# Altium schematic sheet 2-RJ45.SchDoc
size A3
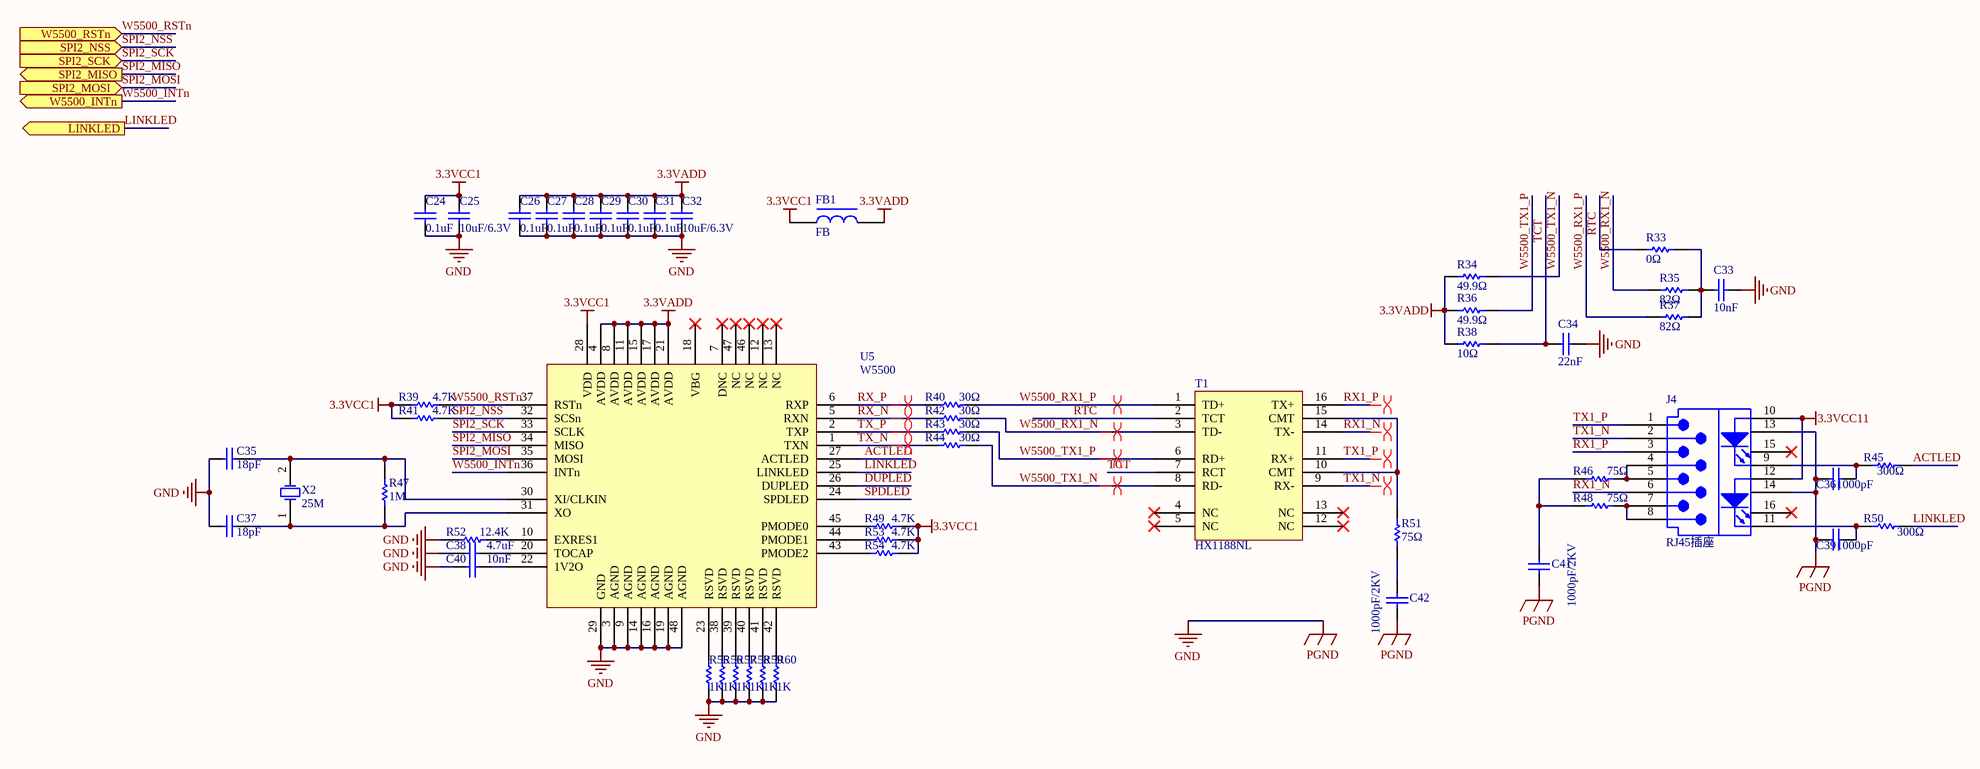
[diagram p0: 2-RJ45.SchDoc]

## Parts
C24  0.1uF  [C0603]
C25  10uF/6.3V  [C0603]
C26  0.1uF  [C0603]
C27  0.1uF  [C0603]
C28  0.1uF  [C0603]
C29  0.1uF  [C0603]
C30  0.1uF  [C0603]
C31  0.1uF  [C0603]
C32  10uF/6.3V  [C0603]
C33  10nF  [C0603]
C34  22nF  [C0603]
C35  18pF  [C0603]
C36  1000pF  [C0603]
C37  18pF  [C0603]
C38  4.7uF  [C0603]
C39  1000pF  [C0603]
C40  10nF  [C0603]
C41  1000pF/2KV  [C1206]
C42  1000pF/2KV  [C1206]
FB1  FB  [L0805]
J4  RJ45插座  [RJ45TH-1x1-2R54-LED]
R33  0Ω  [R0603]
R34  49.9Ω  [R0603]
R35  82Ω  [R0603]
R36  49.9Ω  [R0603]
R37  82Ω  [R0603]
R38  10Ω  [R0603]
R39  4.7K  [R0603]
R40  30Ω  [R0603]
R41  4.7K  [R0603]
R42  30Ω  [R0603]
R43  30Ω  [R0603]
R44  30Ω  [R0603]
R45  300Ω  [R0603]
R46  75Ω  [R0805]
R47  1M  [R0603]
R48  75Ω  [R0805]
R49  4.7K  [R0603]
R50  300Ω  [R0603]
R51  75Ω  [R1206]
R52  12.4K  [R0603]
R53  4.7K  [R0603]
R54  4.7K  [R0603]
R55  1K  [R0603]
R56  1K  [R0603]
R57  1K  [R0603]
R58  1K  [R0603]
R59  1K  [R0603]
R60  1K  [R0603]
T1  HX1188NL  [SOP16-1R27-7R11x12R7]
U5  W5500  [TQFN48-0R5-7X7]
X2  25M  [CRY2SM-6R0x3R5]

## Ports
LINKLED (out), SPI2_MISO (out), SPI2_MOSI (in), SPI2_NSS (in), SPI2_SCK (in), W5500_INTn (out), W5500_RSTn (in)

## Nets
3.3VADD: C26.2 C27.2 C28.2 C29.2 C30.2 C31.2 C32.2 FB1.2 R34.2 R36.2 R38.2 U5.4(AVDD) U5.8(AVDD) U5.11(AVDD) U5.15(AVDD) U5.17(AVDD) U5.21(AVDD)
3.3VCC1: C24.2 C25.2 FB1.1 R39.2 R41.2 R49.2 R53.2 R54.2 U5.28(VDD)
3.3VCC11: J4.10(A1) J4.12(A2)
GND: C24.1 C25.1 C26.1 C27.1 C28.1 C29.1 C30.1 C31.1 C32.1 C33.1 C34.1 C35.1 C36.1 C37.1 C38.1 C39.1 C40.1 C41.1 C42.1 J4.13 J4.14 R52.1 R55.1 R56.1 R57.1 R58.1 R59.1 R60.1 U5.3(AGND) U5.9(AGND) U5.14(AGND) U5.16(AGND) U5.19(AGND) U5.29(GND) U5.48(AGND)  [also labelled PGND]
ACTLED: R45.2 U5.27(ACTLED)
DUPLED: U5.26(DUPLED)
LINKLED: R50.2 U5.25(LINKLED) ; port LINKLED
RTC: R33.2 T1.2(TCT)
RX1_N: J4.6(RX-) T1.14(TX-)
RX1_P: J4.3(RX+) T1.16(TX+)
RX_N: R42.1 U5.5(RXN)
RX_P: R40.1 U5.6(RXP)
SPDLED: U5.24(SPDLED)
SPI2_MISO: U5.34(MISO) ; port SPI2_MISO
SPI2_MOSI: U5.35(MOSI) ; port SPI2_MOSI
SPI2_NSS: R41.1 U5.32(SCSn) ; port SPI2_NSS
SPI2_SCK: U5.33(SCLK) ; port SPI2_SCK
TCT: C34.2 R38.1 T1.7(RCT)
TX1_N: J4.2(TX-) T1.9(RX-)
TX1_P: J4.1(TX+) T1.11(RX+)
TX_N: R44.1 U5.1(TXN)
TX_P: R43.1 U5.2(TXP)
W5500_INTn: U5.36(INTn) ; port W5500_INTn
W5500_RSTn: R39.1 U5.37(RSTn) ; port W5500_RSTn
W5500_RX1_N: R35.2 R42.2 T1.3(TD-)
W5500_RX1_P: R37.2 R40.2 T1.1(TD+)
W5500_TX1_N: R34.1 R44.2 T1.8(RD-)
W5500_TX1_P: R36.1 R43.2 T1.6(RD+)
NetC33_2: C33.2 R33.1 R35.1 R37.1
NetC35_2: C35.2 R47.2 U5.30(XI/CLKIN) X2.2(OSC2)
NetC36_2: C36.2 J4.9(K1) R45.1
NetC37_2: C37.2 R47.1 U5.31(XO) X2.1(OSC1)
NetC38_2: C38.2 U5.20(TOCAP)
NetC39_2: C39.2 J4.11(K2) R50.1
NetC40_2: C40.2 U5.22(1V2O)
NetC41_2: C41.2 R46.1 R48.1
NetC42_2: C42.2 R51.1
NetJ4_4: J4.4(NC) J4.5(NC) R46.2
NetJ4_7: J4.7(NC) J4.8(NC) R48.2
NetR49_1: R49.1 U5.45(PMODE0)
NetR51_2: R51.2 T1.10(CMT) T1.15(CMT)
NetR52_2: R52.2 U5.10(EXRES1)
NetR53_1: R53.1 U5.44(PMODE1)
NetR54_1: R54.1 U5.43(PMODE2)
NetR55_2: R55.2 U5.23(RSVD)
NetR56_2: R56.2 U5.38(RSVD)
NetR57_2: R57.2 U5.39(RSVD)
NetR58_2: R58.2 U5.40(RSVD)
NetR59_2: R59.2 U5.41(RSVD)
NetR60_2: R60.2 U5.42(RSVD)

Not connected (* = marked no-connect by the designer): J4 15* 16*; T1 4(NC)* 5(NC)* 12(NC)* 13(NC)*; U5 7(DNC)* 12(NC)* 13(NC)* 18(VBG)* 46(NC)* 47(NC)*

## Layout directives
differential pair: RX1_N, RX1_P, RX_N, RX_P, TX1_N, TX1_P, TX_N, TX_P, W5500_RX1_N, W5500_RX1_P, W5500_TX1_N, W5500_TX1_P

## Library data of the parts
C24 C26-C31 = 0.1uF贴片电容: 贴片电容_GRM188R71H104KA01D_0.1uF±10%,50V,0603; code: 01010045
C25 C32 = 10uF贴片电容: 贴片电容_GRM188R60J106ME47D_10uF±20%,6.3V,0603; code: 01010037
C33 C40 = 0.1uF贴片电容: 贴片电容_10nF±10%,50V,0603
C34 = 27nF贴片电容: 贴片电容_22nF±5%,50V,0603; code: 01010054
C35 C37 = 20pF贴片电容: 贴片电容_18pF±5%,50V,0603
C36 C39 = 1000pF贴片电容: 贴片电容_GRM188R71H102KA01_1000pF±10%,50V,0603; code: 01010093
C38 = 1uF贴片电容: 贴片电容_4.7uF±10%,50V,0603
C41 C42 = 10uF贴片电容: 贴片电容_1000pF/2KV
FB1 = 0805贴片磁珠: 贴片磁珠_600R,0805; code: 01030023
J4 = RJ45弯脚带灯: RJ45插座_1*1,带左黄右绿灯,弯脚; MPN: 朱迅; code: 01090042
R33 = 0Ω贴片电阻: 贴片电阻_0Ω±5%,0603; code: 01020010
R34 R36 = 51Ω贴片电阻: 贴片电阻_49.9Ω±1%,0603; code: 01020126
R35 R37 = 51Ω贴片电阻: 贴片电阻_82Ω±1%,0603; code: 01020196
R38 = 10Ω贴片电阻: 贴片电阻_10Ω±5%,0603; code: 01020104
R39 R41 R49 R53 R54 = 4.7K贴片电阻: 贴片电阻_4.7K±5%,0603; code: 01020012
R40 R42-R44 = 30Ω贴片电阻: 贴片电阻_30Ω±5%,0603; code: 01020108
R45 R50 = 300Ω贴片电阻: 贴片电阻_300Ω±5%,0603; code: 01020008
R46 R48 = 75Ω贴片电阻: 贴片电阻_75Ω±5%,0805; code: 01020068
R47 = 1M贴片电阻: 贴片电阻_1M±5%,0603; code: 01020093
R51 = 75Ω贴片电阻: 贴片电阻_75Ω±5%,1206; code: 01020197
R52 = 12K贴片电阻: 贴片电阻_12.4K±1%,0603
R55-R60 = 1K贴片电阻: 贴片电阻_1K±5%,0603; code: 01020082
T1 = HX1188NL: 网络变压器_HX1188NL_百兆,SOIC16; code: 01060114
U5 = W5500: 以太网控制器_W5500_LQFP48; code: 01060113
X2 = 25M贴片无源晶体: 贴片无源晶体_25MHz,30ppm,6035封装; code: 03050012